# EAGLE design clock (EAGLE 6.6.0)
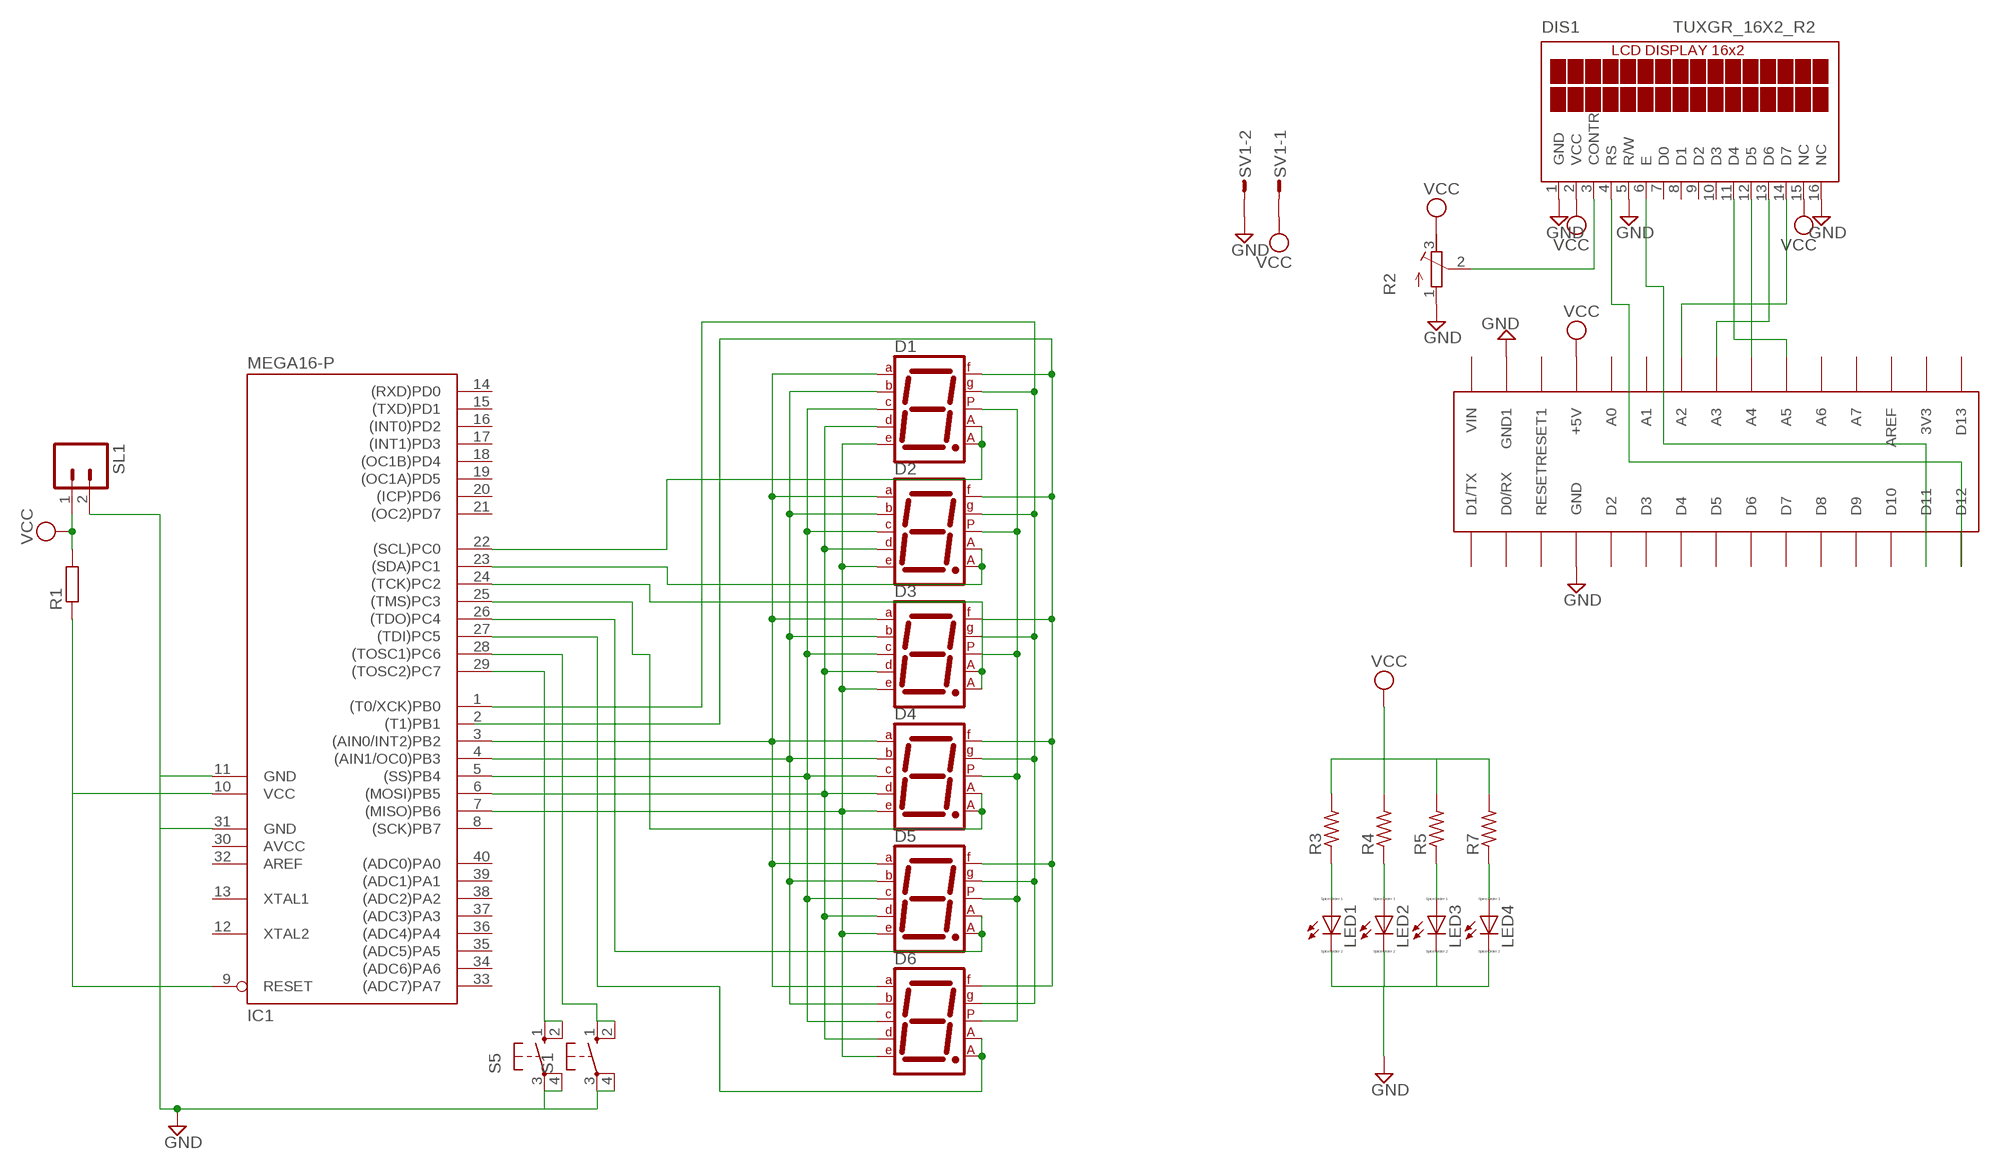
[diagram p0: schematic, sheet 1]

## Parts
D1  7SEG-CA  [7SEG-13]
D2  7SEG-CA  [7SEG-13]
D3  7SEG-CA  [7SEG-13]
D4  7SEG-CA  [7SEG-13]
D5  7SEG-CA  [7SEG-13]
D6  7SEG-CA  [7SEG-13]
DIS1  TUXGR_16X2_R2  [TUXGR_16X2_R2]
IC1  MEGA16-P  [DIL40]
LED1  LED_ESML0603  [LED_SML0603]
LED2  LED_ESML0603  [LED_SML0603]
LED3  LED_ESML0603  [LED_SML0603]
LED4  LED_ESML0603  [LED_SML0603]
R1  R-EU_0204/7  [0204/7]
R2  R-TRIMM3339P  [RTRIM3339P]
R3  R-US_R0603  [R0603]
R4  R-US_R0603  [R0603]
R5  R-US_R0603  [R0603]
R7  R-US_R0603  [R0603]
S1  10-XX  [B3F-10XX]
S5  10-XX  [B3F-10XX]
SL1  M02  [02P]
SV1  L02P  [L02P]
U$1  ARDUINONANO  [PDIP-32]

## Nets
GND: DIS1.1(GND) DIS1.5(R/W) DIS1.16(NC) IC1.11(GND) IC1.31(GND) LED1.C LED2.C LED3.C LED4.C R2.1(E) S1.3(P) S1.4(P1) S5.3(P) S5.4(P1) SL1.2 SV1.2 U$1.GND U$1.GND1
N$1: D1.7(A) D2.7(A) D3.7(A) D4.7(A) D5.7(A) D6.7(A) IC1.3((AIN0/INT2)PB2)
N$2: D1.6(B) D2.6(B) D3.6(B) D4.6(B) D5.6(B) D6.6(B) IC1.4((AIN1/OC0)PB3)
N$3: D1.4(C) D2.4(C) D3.4(C) D4.4(C) D5.4(C) D6.4(C) IC1.5((SS)PB4)
N$4: D1.2(D) D2.2(D) D3.2(D) D4.2(D) D5.2(D) D6.2(D) IC1.6((MOSI)PB5)
N$5: D1.1(E) D2.1(E) D3.1(E) D4.1(E) D5.1(E) D6.1(E) IC1.7((MISO)PB6)
N$6: D1.9(F) D2.9(F) D3.9(F) D4.9(F) D5.9(F) D6.9(F)
N$7: D1.10(G) D2.10(G) D3.10(G) D4.10(G) D5.10(G) D6.10(G) IC1.1((T0/XCK)PB0)
N$8: D1.5(DP) D2.5(DP) D3.5(DP) D4.5(DP) D5.5(DP) D6.5(DP)
N$9: D6.3(CA1) D6.8(CA2) IC1.27((TDI)PC5)
N$10: D5.3(CA1) D5.8(CA2) IC1.26((TDO)PC4)
N$11: D4.3(CA1) D4.8(CA2) IC1.25((TMS)PC3)
N$12: D3.3(CA1) D3.8(CA2) IC1.24((TCK)PC2)
N$13: D2.3(CA1) D2.8(CA2) IC1.23((SDA)PC1)
N$14: D1.3(CA1) D1.8(CA2) IC1.22((SCL)PC0)
N$15: LED1.A R3.1
N$16: IC1.28((TOSC1)PC6) S1.1(S) S1.2(S1)
N$17: IC1.29((TOSC2)PC7) S5.1(S) S5.2(S1)
N$18: LED2.A R4.1
N$19: IC1.9(RESET) IC1.10(VCC) R1.1
N$20: DIS1.4(RS) U$1.D12
N$21: DIS1.6(E) U$1.D11
N$22: DIS1.3(CONTR) R2.2(S)
N$23: DIS1.14(D7) U$1.A2
N$24: DIS1.13(D6) U$1.A3
N$25: DIS1.12(D5) U$1.A4
N$26: DIS1.11(D4) U$1.A5
N$27: LED3.A R5.1
N$28: LED4.A R7.1
VCC: DIS1.2(VCC) DIS1.15(NC) R1.2 R2.3(A) R3.2 R4.2 R5.2 R7.2 SL1.1 SV1.1 U$1.+5V
Unconnected: DIS1.7(D0) DIS1.8(D1) DIS1.9(D2) DIS1.10(D3) IC1.2((T1)PB1) IC1.8((SCK)PB7) IC1.12(XTAL2) IC1.13(XTAL1) IC1.14((RXD)PD0) IC1.15((TXD)PD1) IC1.16((INT0)PD2) IC1.17((INT1)PD3) IC1.18((OC1B)PD4) IC1.19((OC1A)PD5) IC1.20((ICP)PD6) IC1.21((OC2)PD7) IC1.32(AREF) IC1.33((ADC7)PA7) IC1.34((ADC6)PA6) IC1.35((ADC5)PA5) IC1.36((ADC4)PA4) IC1.37((ADC3)PA3) IC1.38((ADC2)PA2) IC1.39((ADC1)PA1) IC1.40((ADC0)PA0) U$1.3V3 U$1.A0 U$1.A1 U$1.A6 U$1.A7 U$1.AREF U$1.D0/RX U$1.D1/TX U$1.D2 U$1.D3 U$1.D4 U$1.D5 U$1.D6 U$1.D7 U$1.D8 U$1.D9 U$1.D10 U$1.D13 U$1.RESET U$1.RESET1 U$1.VIN

## Power pins joined to a net without a drawn wire
AVCC: IC1.30(AVCC)

## Library data of the parts
D1-D6 = special:7SEG-CA: 7-segment DISPLAY single anode, 13 mm
DIS1 = display-lcd:TUXGR_16X2_R2: Tuxgraphics LCD display 16x2 characters reflective, without background light Source: tuxgr_12x2_r2.pdf; OC_FARNELL: unknown; OC_NEWARK: unknown
IC1 = atmel:MEGA16-P: MICROCONTROLLER 16 Kbytes FLASH 1 kbytes SRAM 512 bytes EEPROM USART 8-channel 10 bit ADC Source: avr.lbr; MPN: ATMEGA16-16PU; OC_FARNELL: 9171142; OC_NEWARK: 01M6885
LED1-LED4 = eagle-ltspice:LED_E: LED Source: http://www.osram.convergy.de Source: www.luxeon.com Source: www.kingbright.com; SPICEMODEL: NONE; SPICEPREFIX: D; SPICETYPE: diode
R1 = resistor:R-EU_: RESISTOR, European symbol
R2 = resistor:R-TRIMM: Trimm resistor
R3-R5 R7 = resistor:R-US_: RESISTOR, American symbol
S1 S5 = switch-omron:10-XX: OMRON SWITCH; MPN: B3F-1000; OC_FARNELL: 176432; OC_NEWARK: 36M3542
SL1 = con-amp-quick:M02: AMP QUICK CONNECTOR; OC_FARNELL: unknown; OC_NEWARK: unknown
SV1 = con-amp-mt:L02P: AMP MT CONNECTOR; OC_FARNELL: unknown; OC_NEWARK: unknown
U$1 = jet-lib:ARDUINONANO

## Board
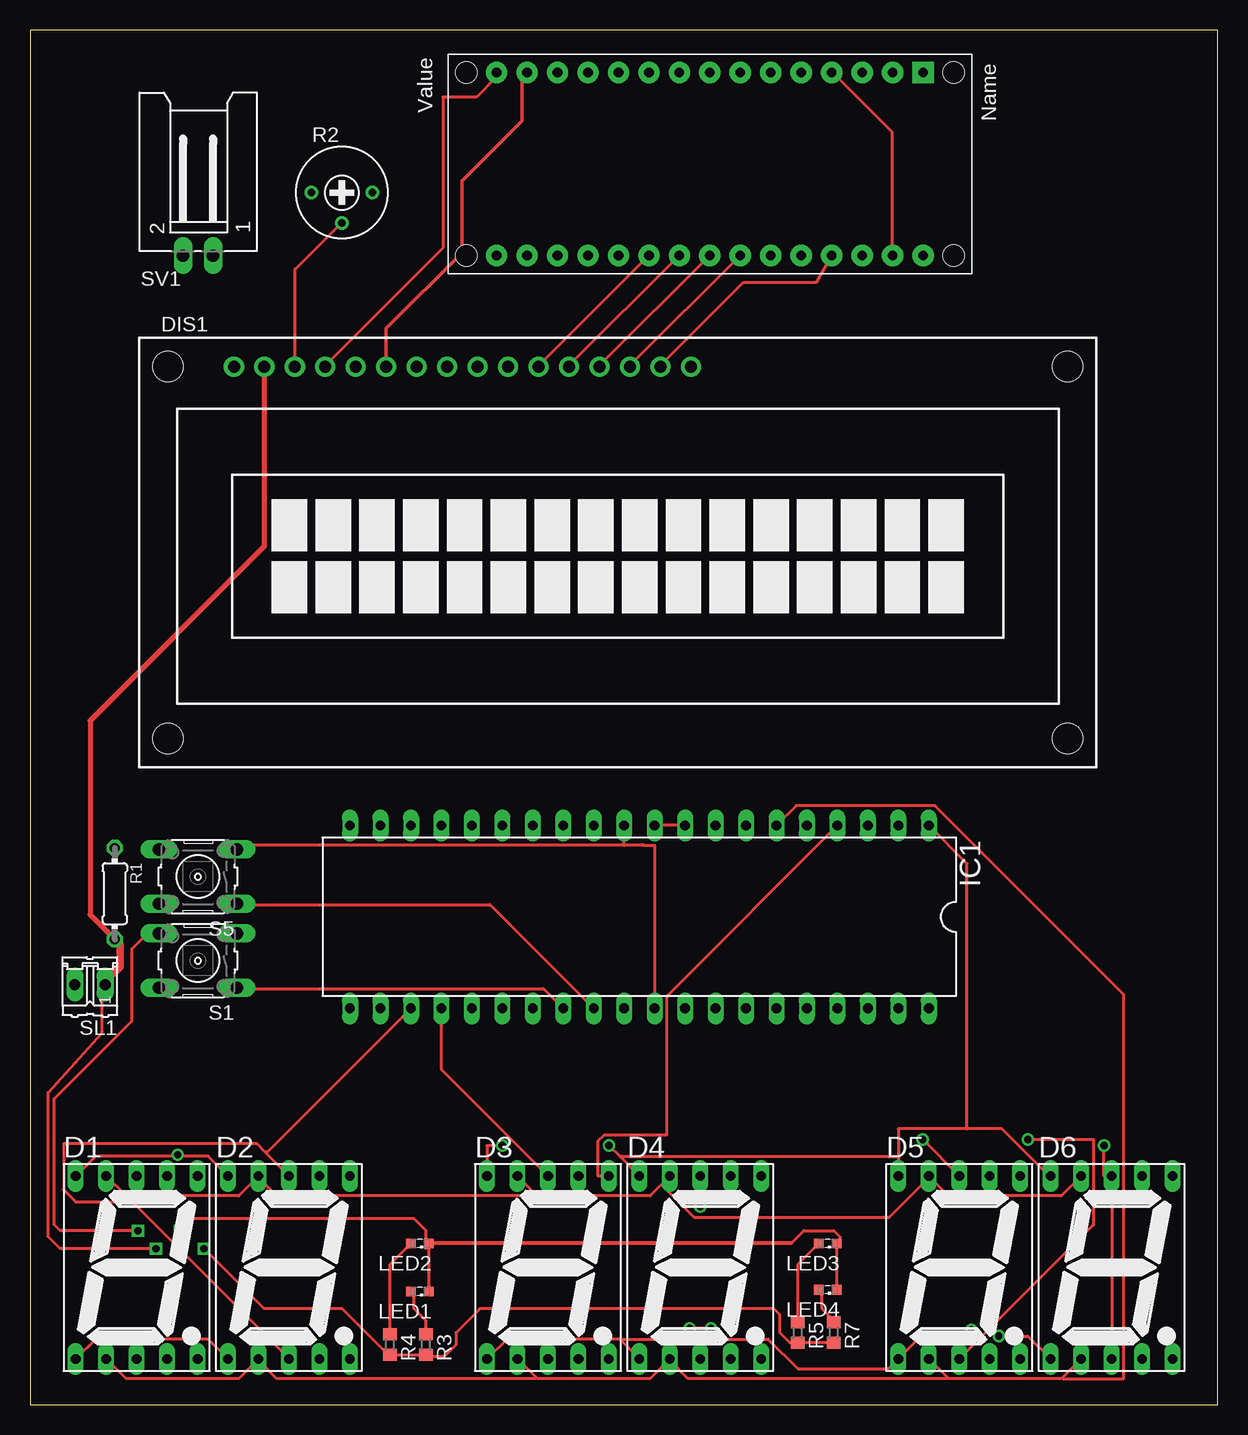
[diagram p1: board, top side]
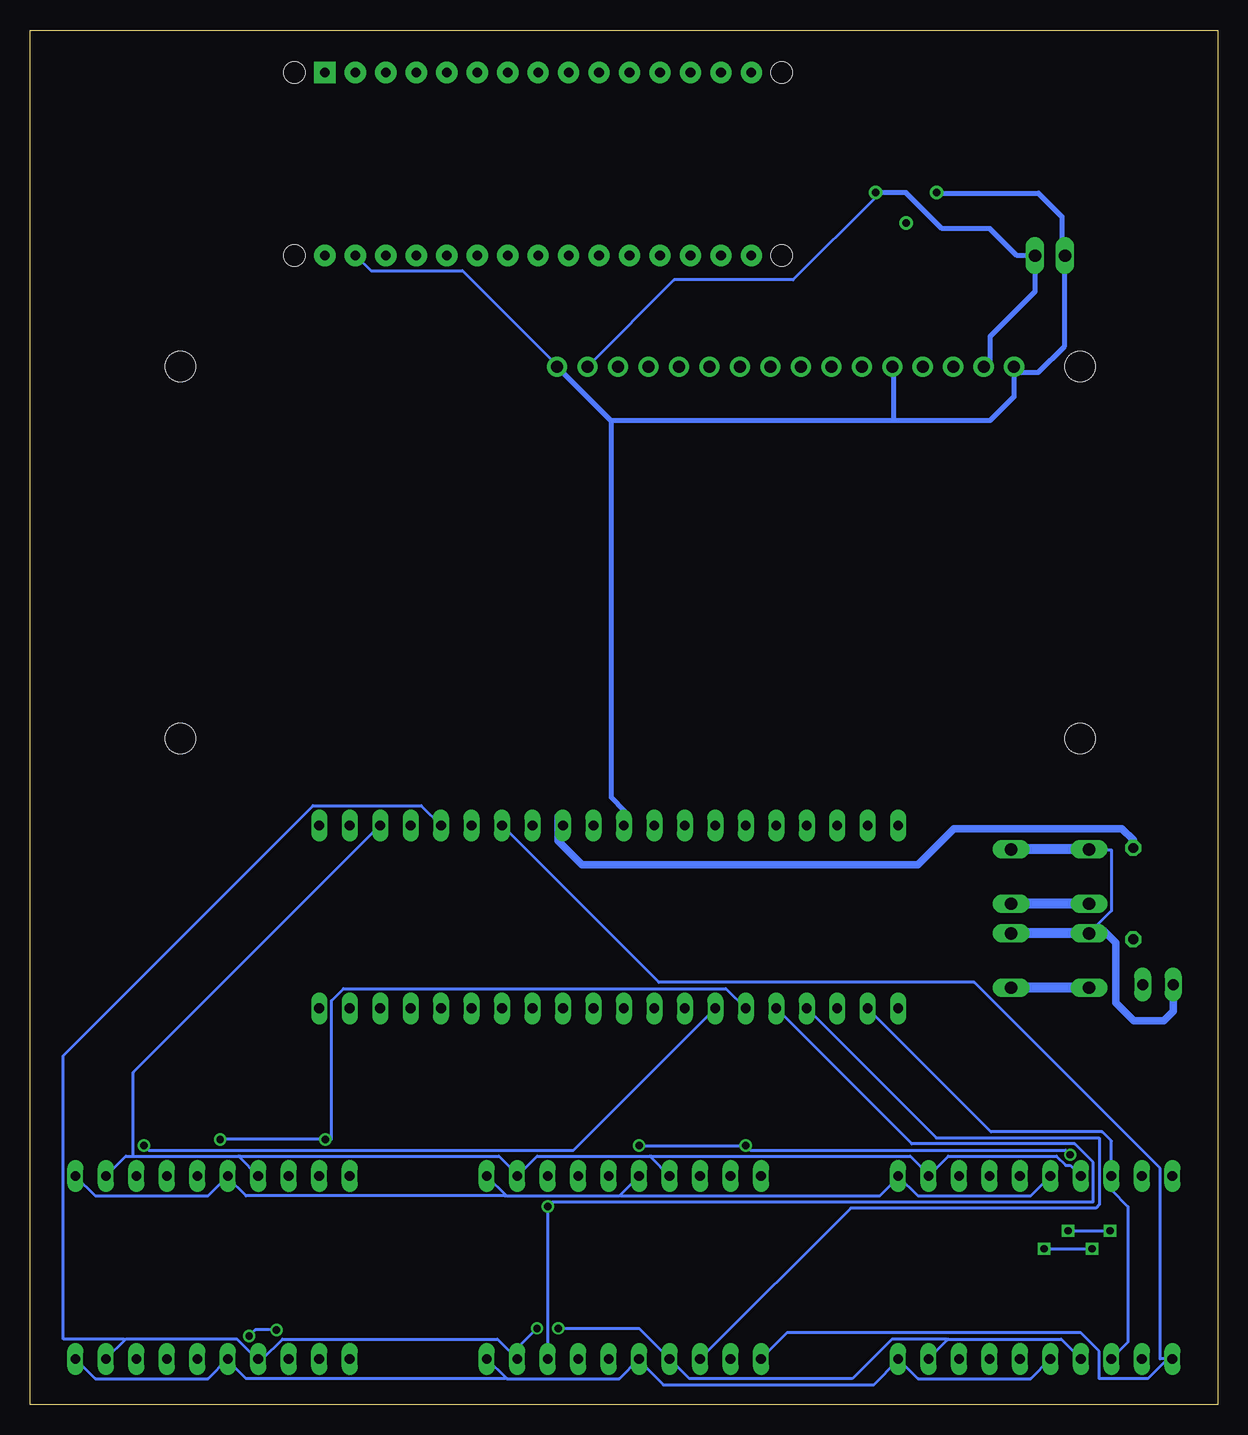
[diagram p2: board, bottom side, seen from below]

Size 99.04 x 114.55 mm. Coordinates in mm from the lower left corner, seen from the top.
Outline: 0,0 99.04,0 99.04,114.55 0,114.55 0,0
Copper layers (1*16): Top 0.035mm / dielectric 1.5mm / Bottom 0.035mm
Design rules "default": minimum track width 10mil, minimum drill 24mil, track to track 8mil, track to pad 8mil, pad to pad 8mil, via to via 8mil, smd to smd 8mil, copper to edge 40mil, drill to drill 8mil, minimum pad ring 10mil, minimum via ring 8mil, stop-mask expansion 4mil, vias tented up to drill 0mil, thermal gap 10mil

### Footprints (pad centres in the part's own frame; a part is rotated, then mirrored left to right if it is on the bottom)
7SEG-13 = drill 0.813 long: 1 -5.08,-7.62; 2 -2.54,-7.62; 3 0,-7.62; 4 2.54,-7.62; 5 5.08,-7.62; 6 5.08,7.62; 7 2.54,7.62; 8 0,7.62; 9 -2.54,7.62; 10 -5.08,7.62
TUXGR_16X2_R2 = drill 1 pad 1.676: 1 -32,15.5; 2 -29.46,15.5; 3 -26.92,15.5; 4 -24.38,15.5; 5 -21.84,15.5; 6 -19.3,15.5; 7 -16.76,15.5; 8 -14.22,15.5; 9 -11.68,15.5; 10 -9.14,15.5; 11 -6.6,15.5; 12 -4.06,15.5; 13 -1.52,15.5; 14 1.02,15.5; 15 3.56,15.5; 16 6.1,15.5 | hole 2.5: -37.5,-15.5; 37.5,-15.5; -37.5,15.5; 37.5,15.5
DIL40 = drill 0.813 long: 1 -24.13,-7.62; 2 -21.59,-7.62; 3 -19.05,-7.62; 4 -16.51,-7.62; 5 -13.97,-7.62; 6 -11.43,-7.62; 7 -8.89,-7.62; 8 -6.35,-7.62; 9 -3.81,-7.62; 10 -1.27,-7.62; 11 1.27,-7.62; 12 3.81,-7.62; 13 6.35,-7.62; 14 8.89,-7.62; 15 11.43,-7.62; 16 13.97,-7.62; 17 16.51,-7.62; 18 19.05,-7.62; 19 21.59,-7.62; 20 24.13,-7.62; 21 24.13,7.62; 22 21.59,7.62; 23 19.05,7.62; 24 16.51,7.62; 25 13.97,7.62; 26 11.43,7.62; 27 8.89,7.62; 28 6.35,7.62; 29 3.81,7.62; 30 1.27,7.62; 31 -1.27,7.62; 32 -3.81,7.62; 33 -6.35,7.62; 34 -8.89,7.62; 35 -11.43,7.62; 36 -13.97,7.62; 37 -16.51,7.62; 38 -19.05,7.62; 39 -21.59,7.62; 40 -24.13,7.62
LED_SML0603 = smd 0.8 x 0.8: A 0.75,0; C -0.75,0
0204/7 = drill 0.813 octagon: 1 -3.81,0; 2 3.81,0
RTRIM3339P = drill 0.61: 1 -2.54,0; 2 0,-2.54; 3 2.54,0
R0603 = smd 1 x 1.1: 1 -0.85,0; 2 0.85,0
B3F-10XX = drill 1.016 long: 1 -3.251,2.261; 2 3.251,2.261; 3 -3.251,-2.261; 4 3.251,-2.261
02P = drill 0.914 long: 1 -1.27,0; 2 1.27,0
L02P = drill 1.016 long: 1 1.25,-6.25; 2 -1.25,-6.25
PDIP-32 = drill 0.8 pad 1.778: 3V3 15.24,-35.56; +5V 15.24,-10.16; A0 15.24,-12.7; A1 15.24,-15.24; A2 15.24,-17.78; A3 15.24,-20.32; A4 15.24,-22.86; A5 15.24,-25.4; A6 15.24,-27.94; A7 15.24,-30.48; AREF 15.24,-33.02; D0/RX 0,-5.08; D2 0,-12.7; D3 0,-15.24; D4 0,-17.78; D5 0,-20.32; D6 0,-22.86; D7 0,-25.4; D8 0,-27.94; D9 0,-30.48; D10 0,-33.02; D11 0,-35.56; D12 0,-38.1; D13 15.24,-38.1; GND 0,-10.16; GND1 15.24,-5.08; RESET 0,-7.62; RESET1 15.24,-7.62; VIN 15.24,-2.54 | drill 0.8 pad 1.778 square: D1/TX 0,-2.54 | hole 1.778: 0,0; 0,-40.64; 15.24,-40.64; 15.24,0

### Placement (x,y rotation side)
D1  8.89,11.43 0 top
D2  21.59,11.43 0 top
D3  43.18,11.43 0 top
D4  55.88,11.43 0 top
D5  77.47,11.43 0 top
D6  90.17,11.43 0 top
DIS1  49,71 0 top
IC1  50.8,40.64 180 top
LED1  32.5,9.43 180 top
LED2  32.5,13.43 180 top
LED3  66.5,13.43 180 top
LED4  66.5,9.57 180 top
R1  7.07,42.58 270 top
R2  26,101 0 top
R3  33,5 270 top
R4  30,5 270 top
R5  64,6 270 top
R7  67,6 270 top
S1  14,37 180 top
S5  14,44 180 top
SL1  5,35 180 top
SV1  14,102 0 top
U$1  77,111 270 top

### Tracks (layer width: path | path; a pad name or v marks a point on that pad's centre or on a via)
GND  (via drill 0.6)
  Top 0.254: v17.02,86.49 DIS1.1 | U$1.GND 66.93,111 71.88,106.05 71.88,95.89 U$1.GND1 | 27.18,86.49 DIS1.5 | 54.99,86.49 DIS1.16 | 49.53,46.61 51.05,46.61 51.12,46.67 51.18,46.61 52.07,46.61 IC1.31 | 49.53,46.61 17.53,46.61 17.27,46.35 S5.3 | 49.53,46.61 IC1.11 | LED4.C LED3.C 67.5,13.68 67.5,14 67,14.5 64.5,14.5 63.5,13.5 | LED1.C LED2.C 63.43,13.43 63.5,13.5 | 63.5,13.5 33.5,13.5 33,13 33,14.5 32,15.5 13.5,15.5 v12.5,14.5 | v9,14.5 2.5,14.5 2,15 2,25.5 8.5,32 8.5,38 10,39.5 10.51,39.5 S1.4
  Bottom 0.254: 23.37,100.97 R2.1 | 12.83,95.76 SV1.2 | 17.02,86.61 DIS1.1 | 27.05,86.61 DIS1.5 | DIS1.16 55.12,86.61 62.99,94.49 70.61,94.49 71.88,95.76 U$1.GND1 | S1.4 10.67,39.37 8.89,41.15 8.89,46.23 10.67,46.23 S5.4 | v12.5,14.5 v9,14.5
  Bottom 0.406: 12.83,95.76 12.83,88.17 15,86 16.5,86 DIS1.1 | v17.02,86.49 17.02,83.98 19,82 27,82 | 27,82 50.6,82 | 50.6,82 DIS1.16 | 27.05,86.61 27.05,82.05 27,82 | 23.37,100.97 14.96,100.97 13,99 13,96 SV1.2 | 50.6,82 50.6,50.6 49.5,49.5 49.5,48.26 | IC1.11 49.5,48.26 | 49.5,48.26 49.5,47.5
  Bottom 0.61: SL1.2 3.73,32.77 4.5,32 7,32 8.5,33.5 8.5,38.5 9.5,39.5 10.51,39.5 S1.4
  Bottom 0.813: S5.4 S5.3 | S1.4 S1.3
N$1
  Bottom 0.254: D1.7 12.32,19.94 12.7,19.94 13.46,20.7 22.48,20.7 D2.7 24.13,19.18 25.65,20.7 47.24,20.7 47.31,20.64 | 47.31,20.64 47.37,20.7 56.77,20.7 D4.7 58.42,19.18 59.94,20.7 81.53,20.7 81.6,20.64 | 47.31,20.64 D3.7 | 81.6,20.64 81.66,20.7 90.42,20.7 | 81.6,20.64 D5.7 | 90.42,20.7 91.06,20.7 D6.7 | IC1.3 90.42,27.69 90.42,20.7
N$2
  Top 0.254: IC1.4 53.09,34.04 53.09,22.48 47.88,22.48 47.37,21.97 47.37,19.05 D3.6
  Bottom 0.254: D6.6 93.6,17.4 84.2,17.4 D5.6 82.55,18.92 81.03,17.4 59.44,17.4 59.37,17.46 | D1.6 15.62,17.4 25.02,17.4 D2.6 26.67,18.92 28.19,17.4 49.78,17.4 49.85,17.46 | 49.85,17.46 49.91,17.4 59.31,17.4 59.37,17.46 | 49.85,17.46 D3.6 | D4.6 59.37,17.46
N$3  (via drill 0.61)
  Top 0.254: v56.77,6.35 v54.99,6.35
  Bottom 0.254: D1.4 13.08,5.46 22.48,5.46 22.54,5.4 | D2.4 22.54,5.4 | 22.54,5.4 22.61,5.46 27.18,5.46 30.48,2.16 44.07,2.16 D3.4 48.26,6.35 v54.99,6.35 | 91.12,5.4 91.06,5.46 81.79,5.46 80.14,3.81 D5.4 79.63,3.81 77.98,5.46 60.07,5.46 D4.4 58.8,4.32 v56.77,6.35 | 91.12,5.4 D6.4 | IC1.5 66.42,49.91 75.44,49.91 96.27,29.08 96.27,5.46 91.19,5.46 91.12,5.4
N$4
  Top 0.254: D1.2 8,2.16 17.4,2.16 D2.2 19.05,3.68 20.57,2.16 42.16,2.16 42.23,2.22 | 42.23,2.22 42.29,2.16 51.69,2.16 D4.2 53.34,3.68 54.86,2.16 76.45,2.16 76.52,2.22 | 42.23,2.22 D3.2 | 76.52,2.22 76.58,2.16 85.98,2.16 86.04,2.22 | 76.52,2.22 D5.2 | D6.2 86.04,2.22 | IC1.6 63.88,49.91 75.44,49.91 91.19,34.16 91.19,2.16 86.11,2.16 86.04,2.22
N$5  (via drill 0.61)
  Top 0.254: D3.1 39.75,5.46 49.15,5.46 49.21,5.4 | D4.1 49.21,5.4 | 49.21,5.4 49.28,5.46 61.54,5.46 64,3 71.58,3 D5.1 74.04,5.46 77.72,5.46 v78.49,6.22 | D6.1 83.19,5.71 v80.77,5.71 | D1.1 5.46,5.46 14.86,5.46 D2.1
  Bottom 0.254: v80.77,5.71 80.26,6.22 v78.49,6.22 | IC1.7 46.61,35.18 20.32,35.18 4.83,19.68 4.83,3.81 4.19,3.81 | D3.1 35.94,5.97 11.43,5.97 9.91,4.45 9.91,2.16 5.84,2.16 4.19,3.81 | 4.19,3.81 D1.1
N$6
  Top 0.254: D6.9 85.98,17.4 76.58,17.4 D5.9 74.93,18.92 71.63,15.62 55.37,15.62 52.7,18.29 D4.9 51.69,17.4 42.29,17.4 42.23,17.46 | D1.9 8,17.4 17.4,17.4 D2.9 19.05,18.92 20.57,17.4 42.16,17.4 42.23,17.46 | 42.23,17.46 D3.9
N$7  (via drill 0.61)
  Top 0.254: 72.39,20.7 72.39,22.99 78.11,22.99 | 72.39,20.7 D5.10 | 78.11,22.99 81.03,22.99 84.96,19.05 D6.10 | IC1.1 78.11,45.09 78.11,22.99 | D1.10 5.46,20.7 12.32,20.7 | 12.32,20.7 14.86,20.7 D2.10 | D3.10 38.1,21.59 v39.37,21.59 | D4.10 49.21,20.64 | 49.21,20.64 v48.26,21.59 | v12.32,20.83 12.32,20.7 | 72.39,20.7 49.28,20.7 49.21,20.64
  Bottom 0.254: v48.26,21.59 v39.37,21.59 38.99,21.21 12.7,21.21 v12.32,20.83
N$8
  Bottom 0.254: D6.5 93.6,2.16 84.2,2.16 D5.5 82.55,3.68 81.03,2.16 59.44,2.16 59.37,2.22 | D1.5 15.62,2.16 25.02,2.16 D2.5 26.67,3.68 28.7,1.65 46.23,1.65 48.26,3.68 D3.5 49.91,2.16 59.31,2.16 59.37,2.22 | D4.5 59.37,2.22
N$9  (via drill 0.61)
  Top 0.254: v89.53,21.59 89.53,19.05 D6.8 D6.3
  Bottom 0.254: IC1.27 53.72,21.21 89.15,21.21 v89.53,21.59
N$10  (via drill 0.61)
  Top 0.254: D5.8 v74.42,22.1 | D5.3 88.65,14.99 88.65,22.1 v83.19,22.1
  Bottom 0.254: IC1.26 41.02,34.67 72.9,34.67 73.91,33.66 73.91,22.1 v74.42,22.1 v83.19,22.1
N$11  (via drill 0.61)
  Top 0.254: D4.8 v55.88,16.51
  Bottom 0.254: D4.3 v55.88,16.51 55.5,16.89 10.41,16.89 10.41,20.19 11.94,21.72 25.53,21.72 IC1.25
N$12
  Top 0.254: D3.8 34.29,27.94 IC1.24
  Bottom 0.254: D3.3 30.61,16.38 10.16,16.38 9.91,16.64 9.91,22.23 23.5,22.23 IC1.24
N$13
  Top 0.254: D2.3 8.51,16.89 3.81,16.89 2.79,17.91 2.79,21.72 18.92,21.72 19.62,21.02 | D2.8 19.62,21.02 | IC1.23 19.81,21.08 19.68,21.08 19.62,21.02
N$14
  Bottom 0.254: IC1.22 18.92,22.73 9.65,22.73 8.89,21.97 D1.8 8.89,17.89 7.5,16.5 7.5,5.2 D1.3
N$15
  Top 0.254: R3.1 33,7 32,8 32,9.18 LED1.A
N$16
  Top 0.254: IC1.28 42.8,34.67 17.27,34.67 S1.1
  Bottom 0.813: S1.2 S1.1
N$17
  Top 0.254: IC1.29 38.35,41.66 17.27,41.66 S5.1
  Bottom 0.813: S5.2 S5.1
N$18
  Top 0.254: R4.1 30,11.68 LED2.A
N$19
  Top 0.254: IC1.9 IC1.10
  Bottom 0.61: R1.1 7.07,47.07 8,48 22,48 25,45 53,45 55,47 55,48.65 | 55,49 55,48.65 | 55,48.65 IC1.9
N$20
  Top 0.254: DIS1.4 24.64,86.61 34.42,96.39 34.42,108.97 37.21,108.97 38.86,110.62 38.86,111 U$1.D12
N$21
  Top 0.305: DIS1.6 29.7,89.7 36,96 36,102 41,107 41,110.56 U$1.D11
N$22
  Top 0.254: R2.2 25.91,98.42 22.1,94.61 22.1,86.61 DIS1.3
N$23
  Top 0.254: DIS1.14 50.04,86.61 59.18,95.76 U$1.A2
N$24
  Top 0.254: DIS1.13 47.5,86.61 56.64,95.76 U$1.A3
N$25
  Top 0.254: DIS1.12 44.96,86.61 54.1,95.76 U$1.A4
N$26
  Top 0.254: DIS1.11 42.42,86.61 51.56,95.76 U$1.A5
N$27
  Top 0.254: R5.1 64,11.68 LED3.A
N$28
  Top 0.254: R7.1 67,7 66,8 66,9.32 LED4.A
VCC  (via drill 0.6)
  Top 0.254: DIS1.15 52.58,86.61 59.45,93.49 65.53,93.49 66.8,95.76 U$1.+5V | 28.45,100.97 R2.3 | R7.2 R5.2 63.35,5.15 62.5,6 62.5,7.5 62,8 37.5,8 35.5,6 35.5,5 34.5,4 33.15,4 R3.2 R4.2 29.85,4.15 26,8 19.5,8 v14.5,13 | SL1.1 6,34.73 6,31 1.5,26 1.5,14 2.5,13 v10.5,13
  Top 0.406: DIS1.2 19.54,71.54 5,57 5,40.84 R1.2
  Top 0.61: SL1.1 6.27,35.27 7.5,36.5 7.5,38.34 R1.2
  Bottom 0.254: DIS1.15 52.45,86.61 45.34,93.73 35.43,93.73 28.57,100.58 28.57,100.97 R2.3 | v14.5,13 v10.5,13
  Bottom 0.406: DIS1.2 19,87.04 19,89 15.25,92.75 SV1.1 16.75,95.75 19,98 23,98 26,101 R2.3